# EAGLE design Power distribution PCB (EAGLE 9.4.0)
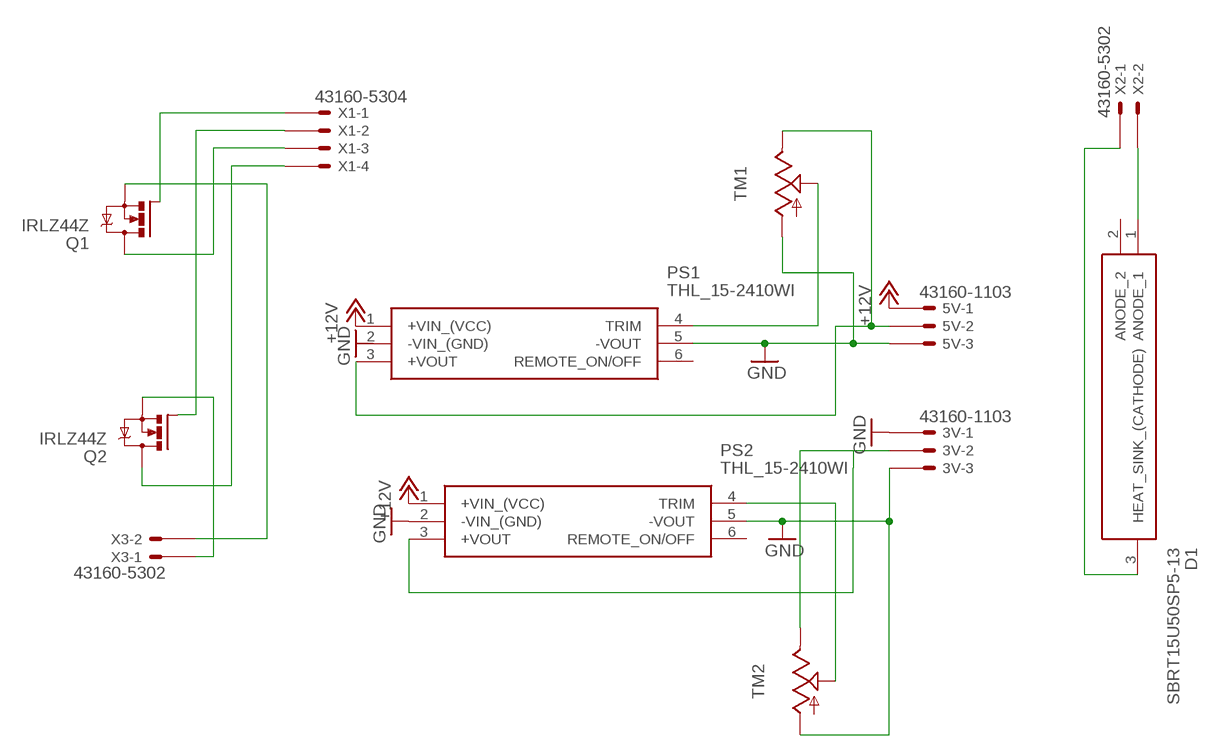
[diagram p0: schematic, sheet 1]

## Parts
3V  43160-1103  [43160-XX03]
5V  43160-1103  [43160-XX03]
D1  SBRT15U50SP5-13  [POWERDI5]
PS1  THL_15-2410WI  [THL152410WI]
PS2  THL_15-2410WI  [THL152410WI]
Q1  IRLZ44Z  [TO220BH]
Q2  IRLZ44Z  [TO220BH]
TM1  TRIM  [6MM]
TM2  TRIM  [6MM]
X1  43160-5304  [43160-XX04]
X2  43160-5302  [43160-XX02]
X3  43160-5302  [43160-XX02]

## Nets
+12V: 5V.1@1(-1:S) PS1.1(+VIN_(VCC)) PS2.1(+VIN_(VCC))
GND: 3V.1@1(-1:S) 3V.3@1(-3:S) 5V.3@1(-3:S) PS1.5(-VOUT) PS2.2(-VIN_(GND)) PS2.5(-VOUT) TM1.A TM2.A
N$1: 5V.2@1(-2:S) PS1.3(+VOUT) TM1.E
N$2: Q1.G X1.1@1(-1:S)
N$3: 3V.2@1(-2:S) PS2.3(+VOUT) TM2.E
N$4: Q1.S X3.2@1(-2:S)
N$5: PS1.4(TRIM) TM1.S
N$6: Q2.S X3.1@1(-1:S)
N$7: PS2.4(TRIM) TM2.S
N$8: Q2.G X1.2@1(-2:S)
N$9: Q1.D X1.3@1(-3:S)
N$10: Q2.D X1.4@1(-4:S)
N$11: D1.1(ANODE_1) X2.2@1(-2:S)
N$12: D1.3(HEAT_SINK_(CATHODE)) X2.1@1(-1:S)
Unconnected: 3V.1@2(-1:S) 3V.2@2(-2:S) 3V.3@2(-3:S) 5V.1@2(-1:S) 5V.2@2(-2:S) 5V.3@2(-3:S) D1.2(ANODE_2) PS1.2(-VIN_(GND)) PS1.6(REMOTE_ON/OFF) PS2.6(REMOTE_ON/OFF) X1.1@2(-1:S) X1.2@2(-2:S) X1.3@2(-3:S) X1.4@2(-4:S) X2.1@2(-1:S) X2.2@2(-2:S) X3.1@2(-1:S) X3.2@2(-2:S)

## Library data of the parts
3V 5V = con-molex:43160-*03: SDA-43160 Connector Source: http://www.molex.com/pdm_docs/sd/431601306_sd.pdf; MF: MOLEX; OC_FARNELL: unknown; OC_NEWARK: unknown
D1 = SamacSys_Parts:SBRT15U50SP5-13: 15A 50V Trench Super Rectifier POWERDI5 Diodes Inc SBRT15U50SP5-13, SMT Schottky Diode, 50V 15A, 3-Pin PowerDI 5 Source: Datasheet <http://uk.rs-online.com/web/p/products/8283301P>; ALLIED_NUMBER: 70550924; DESCRIPTION: 15A 50V Trench Super Rectifier POWERDI5 Diodes Inc SBRT15U50SP5-13, SMT Schottky Diode, 50V 15A, 3-Pin PowerDI 5; HEIGHT: mm; MANUFACTURER_NAME: Diodes Inc.; MANUFACTURER_PART_NUMBER: SBRT15U50SP5-13; RS_PART_NUMBER: 8283301P; RS_PRICE-STOCK: http://uk.rs-online.com/web/p/products/8283301P
PS1 PS2 = SamacSys_Parts:THL_15-2410WI: Isolated DC/DC Converters 9-36Vin 3.3V 3.4A 15W 1x1 Reg Iso SIP Source: Datasheet <https://assets.tracopower.com/20190719114123/THL15WI/documents/thl15wi-datasheet.pdf>; ALLIED_NUMBER: 71626226; ALLIED_PRICE-STOCK: https://www.alliedelec.com/tracopower-thl15-2410wi/71626226/; DESCRIPTION: Isolated DC/DC Converters 9-36Vin 3.3V 3.4A 15W 1x1 Reg Iso SIP; HEIGHT: 10.66mm; MANUFACTURER_NAME: Traco Power; MANUFACTURER_PART_NUMBER: THL 15-2410WI; MOUSER_PART_NUMBER: 495-THL15-2410WI; MOUSER_PRICE-STOCK: https://www.mouser.com/Search/Refine.aspx?Keyword=495-THL15-2410WI
Q1 Q2 = transistor-power:IRLZ44Z: N-Channel HEXFET® Power MOSFET Logic Level AUTOMOTIVE MOSFET Source: http://www.irf.com/product-info/datasheets/data/irlz44zpbf.pdf
TM1 TM2 = adafruit:TRIM
X1 = con-molex:43160-*04: SDA-43160 Connector Source: http://www.molex.com/pdm_docs/sd/431601306_sd.pdf; MF: MOLEX; MPN: 43160-5304; OC_FARNELL: unknown; OC_NEWARK: 92M1500
X2 X3 = con-molex:43160-*02: SDA-43160 Connector Source: http://www.molex.com/pdm_docs/sd/431601306_sd.pdf; MF: MOLEX; MPN: 43160-5302; OC_FARNELL: unknown; OC_NEWARK: 92M1498

## Board
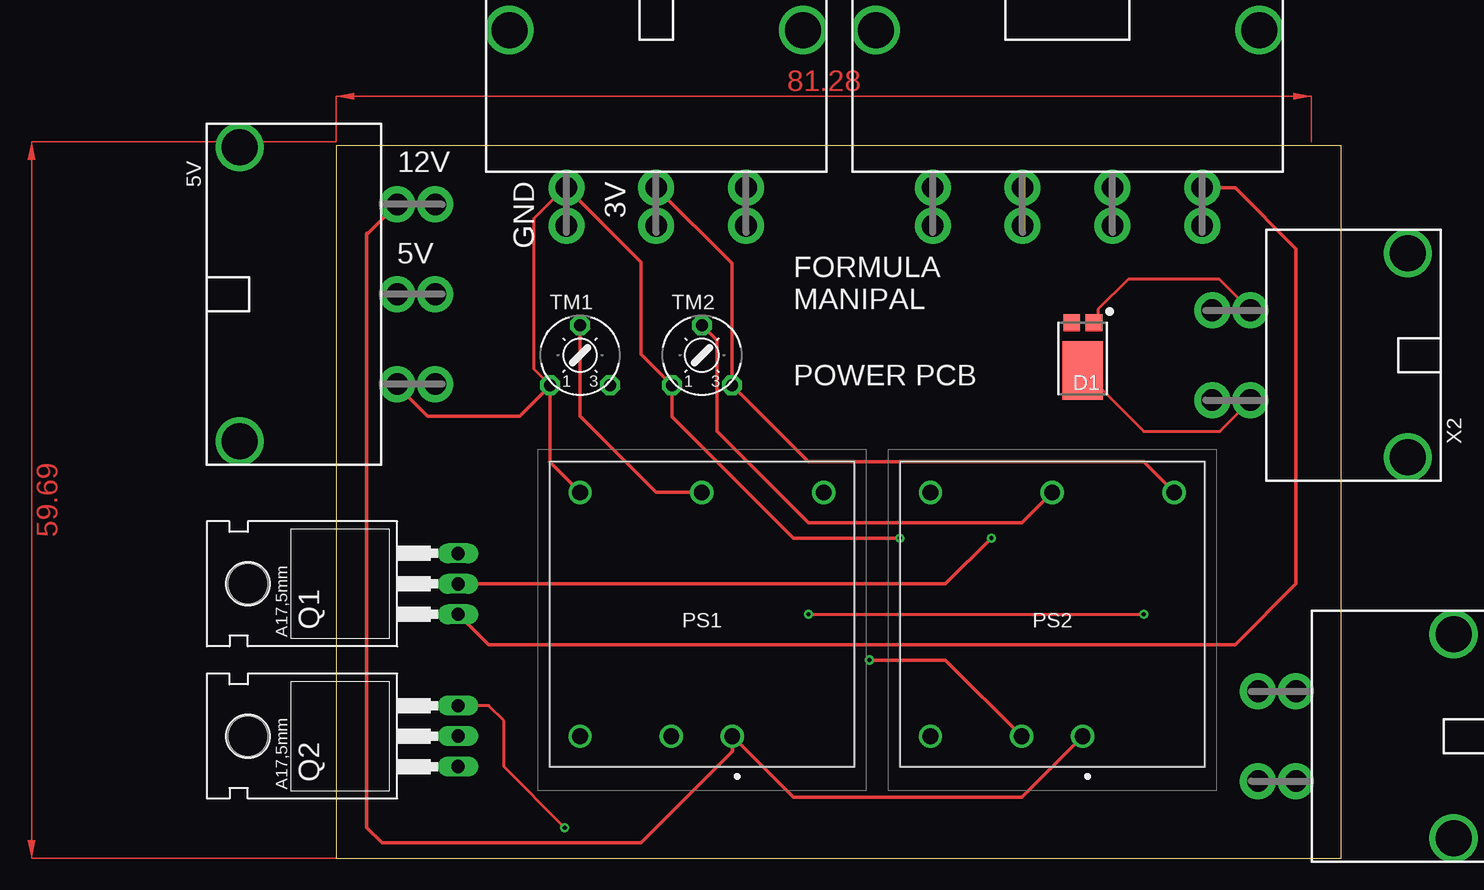
[diagram p1: board, top side]
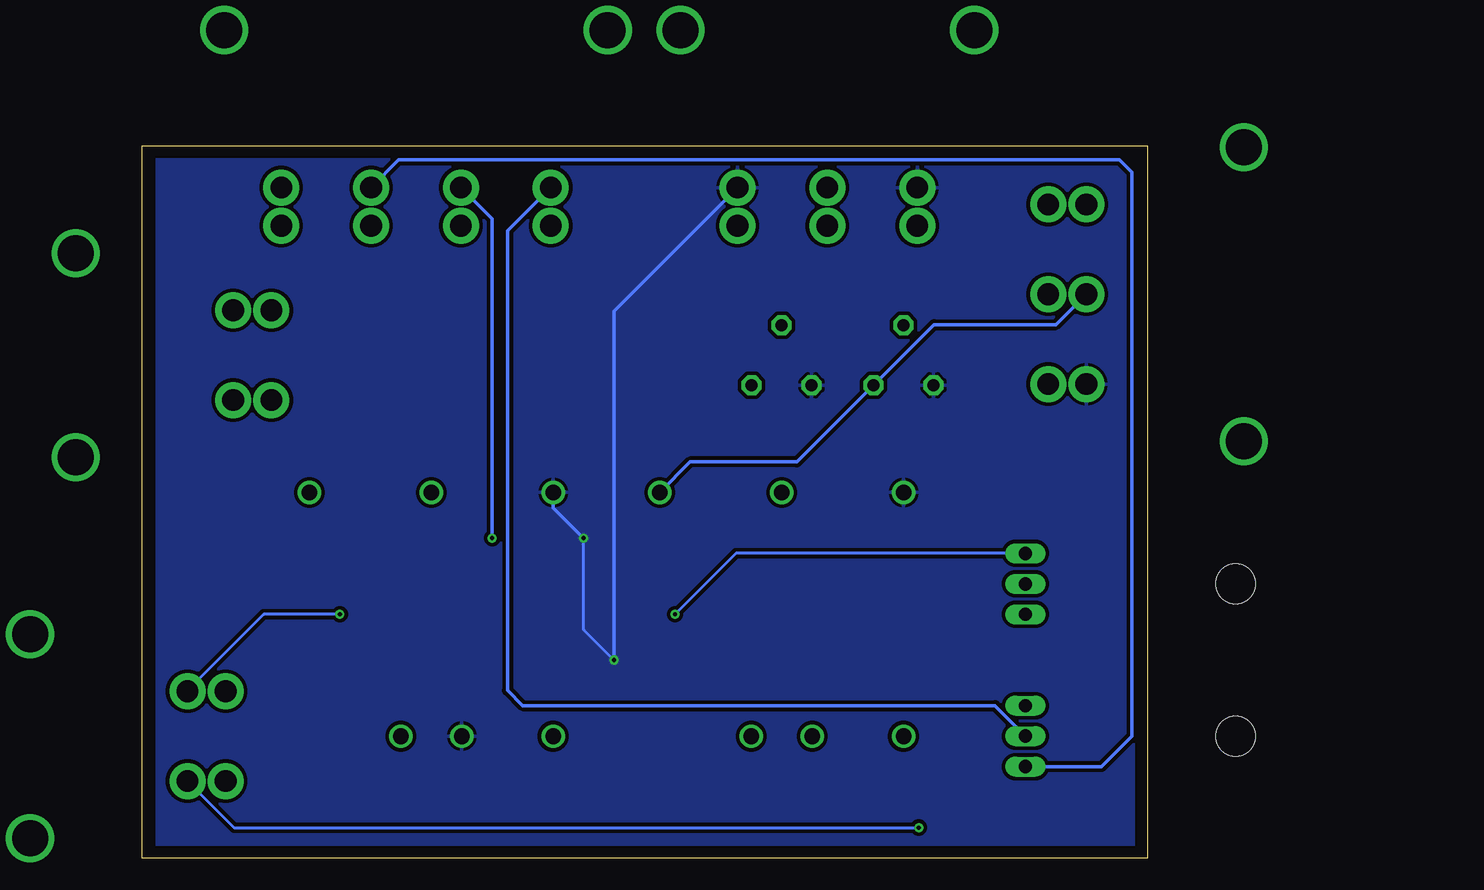
[diagram p2: board, bottom side, seen from below]

Size 83.8 x 59.36 mm. Coordinates in mm from the lower left corner, seen from the top.
Outline: 0,0 83.8,0 83.8,59.36 0,59.36 0,0
Copper layers (1*16): Top 0.035mm / dielectric 1.5mm / Bottom 0.035mm
Design rules "default": minimum track width 6mil, minimum drill 0.35mm, track to track 6mil, track to pad 6mil, pad to pad 6mil, via to via 6mil, smd to smd 6mil, copper to edge 40mil, drill to drill 6mil, minimum pad ring 10mil, minimum via ring 8mil, stop-mask expansion 4mil, vias tented up to drill 0mil, thermal gap 10mil

### Footprints (pad centres in the part's own frame; a part is rotated, then mirrored left to right if it is on the bottom)
43160-XX03 = drill 1.8 pad 3: 1@1 -7.49,0; 1@2 -7.49,3.18; 2@1 0,0; 2@2 0,3.18; 3@1 7.49,0; 3@2 7.49,3.18 | drill 3 pad 3.4: M1 -12.24,-13.13; M2 12.24,-13.13
POWERDI5 = smd 1.39 x 1.4: 1 -0.92,-3.982; 2 0.92,-3.982 | smd 3.36 x 4.86: 3 0,0
THL152410WI = drill 1.3 pad 1.95: 1 0,0; 2 -5.08,0; 3 7.62,20.32; 4 -2.54,20.32; 5 -12.7,20.32; 6 -12.7,0
TO220BH = drill 1.118 long: D 0,-6.35; G -2.54,-6.35; S 2.54,-6.35 | hole 3.302: 0,11.176
6MM = drill 1 pad 1.676 octagon: A -2.5,-2.5; E 2.5,-2.5; S 0,2.5
43160-XX04 = drill 1.8 pad 3: 1@1 -11.235,0; 1@2 -11.235,3.18; 2@1 -3.745,0; 2@2 -3.745,3.18; 3@1 3.745,0; 3@2 3.745,3.18; 4@1 11.235,0; 4@2 11.235,3.18 | drill 3 pad 3.4: M1 -15.985,-13.13; M2 15.985,-13.13
43160-XX02 = drill 1.8 pad 3: 1@1 -3.745,0; 1@2 -3.745,3.18; 2@1 3.745,0; 2@2 3.745,3.18 | drill 3 pad 3.4: M1 -8.495,-13.13; M2 8.495,-13.13

### Placement (x,y rotation side)
3V  26.67,55.88 180 top
5V  5.08,46.99 270 top
D1  62.23,40.64 180 top
PS1  33.02,10.16 0 top
PS2  62.23,10.16 0 top
Q1  3.81,22.86 90 top
Q2  3.81,10.16 90 top
TM1  20.32,41.91 0 top
TM2  30.48,41.91 0 top
X1  60.96,55.88 180 top
X2  76.2,41.91 90 top
X3  80.01,10.16 90 top

### Tracks (layer width: path | path; a pad name or v marks a point on that pad's centre or on a via)
+12V
  Top 0.305: 5V.1@1 2.67,52.07 2.54,52.07 2.54,2.54 3.81,1.27 25.4,1.27 33.02,8.89 PS1.1 38.1,5.08 57.15,5.08 PS2.1
GND  (via drill 0.35)
  Top 0.254: TM1.A 16.51,40.72 16.51,53.34 19.05,55.88 3V.3@1
  Top 0.305: v44.45,16.51 50.8,16.51 PS2.2 | 3V.3@1 25.4,49.66 25.4,41.99 TM2.A 27.98,36.79 38.1,26.67 v46.99,26.67 | TM1.A 17.82,39.37 | 17.82,39.37 17.82,33.06 17.78,33.02 PS1.5 | 5V.3@1 5.08,39.37 7.62,36.83 15.28,36.83 17.82,39.37
  Bottom 0.254: v46.99,26.67 46.99,19.05 v44.45,16.51
  Bottom 0.305: 3V.1@1 44.45,45.59 v44.45,16.51 | v46.99,26.67 49.53,29.21 PS2.5
  pour Bottom (isolate 0.305): 0,59.69 0,0 82.55,0 82.55,59.69
N$1
  Bottom 0.305: 5V.2@1 7.62,44.45 17.78,44.45 TM1.E 29.21,33.02 38.1,33.02 PS1.3
N$2
  Top 0.305: Q1.G 12.7,17.78 74.93,17.78 80.01,22.86 80.01,50.8 74.93,55.88 X1.1@1
N$3
  Top 0.305: 3V.2@1 32.98,49.57 TM2.E 39.37,33.02 67.31,33.02 PS2.3
N$4  (via drill 0.35)
  Top 0.254: v39.37,20.32 v67.31,20.32
  Bottom 0.254: Q1.S 34.29,25.4 v39.37,20.32 | v67.31,20.32 73.66,20.32 80.01,13.97 X3.2@1
N$5
  Top 0.305: TM1.S 20.32,36.83 26.67,30.48 PS1.4
N$6  (via drill 0.35)
  Top 0.254: v19.05,2.54 13.97,7.62 13.97,11.43 12.7,12.7 Q2.S
  Bottom 0.254: X3.1@1 76.14,2.54 v19.05,2.54
N$7
  Top 0.305: TM2.S 31.75,43.14 31.75,35.56 39.37,27.94 57.15,27.94 PS2.4
N$8
  Bottom 0.305: X1.2@1 62.39,58.19 2.31,58.19 1.27,57.15 1.27,10.16 3.81,7.62 Q2.G
N$9  (via drill 0.35)
  Top 0.305: Q1.D 50.8,22.86 v54.61,26.67
  Bottom 0.305: X1.3@1 54.61,53.27 v54.61,26.67
N$10
  Bottom 0.305: X1.4@1 53.34,52.27 53.34,13.97 52.07,12.7 12.7,12.7 Q2.D
N$11
  Top 0.254: X2.2@1 73.59,48.26 66.04,48.26 63.5,45.72 63.5,44.45 63.32,44.45 D1.1
N$12
  Top 0.254: D1.3 67.31,35.56 73.66,35.56 76.2,38.1 X2.1@1
(copper drawn outside any net)
  shapes: Top area x2

### Text on the board
tNames: 12V | 3V | GND | 5V | FORMULA / MANIPAL | POWER PCB